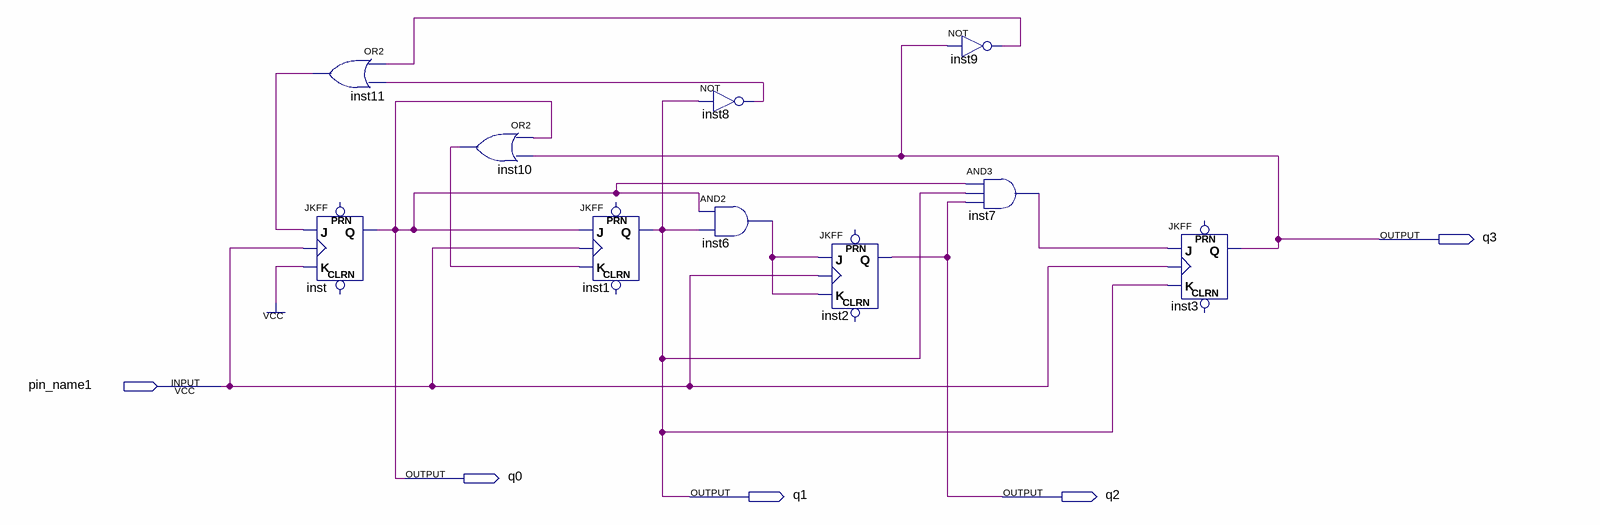
[diagram p0: schematic sheet]
// Quartus schematic divizor11.bdf as structural Verilog: 10 symbols, 5 pins
module divizor11 (
  input  pin_name1,
  output q3,
  output q0,
  output q1,
  output q2
);

  wire inst6_out, inst7_out, inst8_out, inst9_out, inst10_out, inst11_out;

  or inst11 (inst11_out, inst9_out, inst8_out);
  JKFF inst (.K(1'b1), .J(inst11_out), .CLK(pin_name1), .Q(q0));  // open: PRN, CLRN
  or inst10 (inst10_out, q0, q3);
  JKFF inst1 (.K(inst10_out), .J(q0), .CLK(pin_name1), .Q(q1));  // open: PRN, CLRN
  not inst8 (inst8_out, q1);
  and inst6 (inst6_out, q0, q1);
  JKFF inst2 (.K(inst6_out), .J(inst6_out), .CLK(pin_name1), .Q(q2));  // open: PRN, CLRN
  not inst9 (inst9_out, q3);
  and inst7 (inst7_out, q0, q1, q2);
  JKFF inst3 (.K(q1), .J(inst7_out), .CLK(pin_name1), .Q(q3));  // open: PRN, CLRN
endmodule
